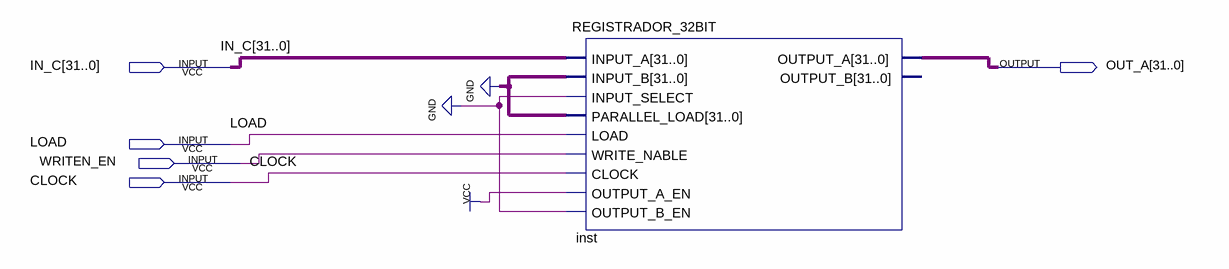
[diagram p0: schematic sheet]
// Quartus schematic H.bdf as structural Verilog: 1 symbols, 5 pins
module H (
  input  [31:0] IN_C,
  input  LOAD,
  input  WRITEN_EN,
  input  CLOCK,
  output [31:0] OUT_A
);

  REGISTRADOR_32BIT inst (
    .INPUT_A(IN_C), .INPUT_B({32{1'b0}}), .INPUT_SELECT(1'b0), .PARALLEL_LOAD({32{1'b0}}), .LOAD(LOAD),
    .WRITE_NABLE(WRITEN_EN), .CLOCK(CLOCK), .OUTPUT_A_EN(1'b1), .OUTPUT_B_EN(1'b0), .OUTPUT_A(OUT_A));  // open: OUTPUT_B
endmodule
